# Altium schematic sheet slave_interface.SchDoc
size A4; SheetNumber: 5; SheetTotal: 5
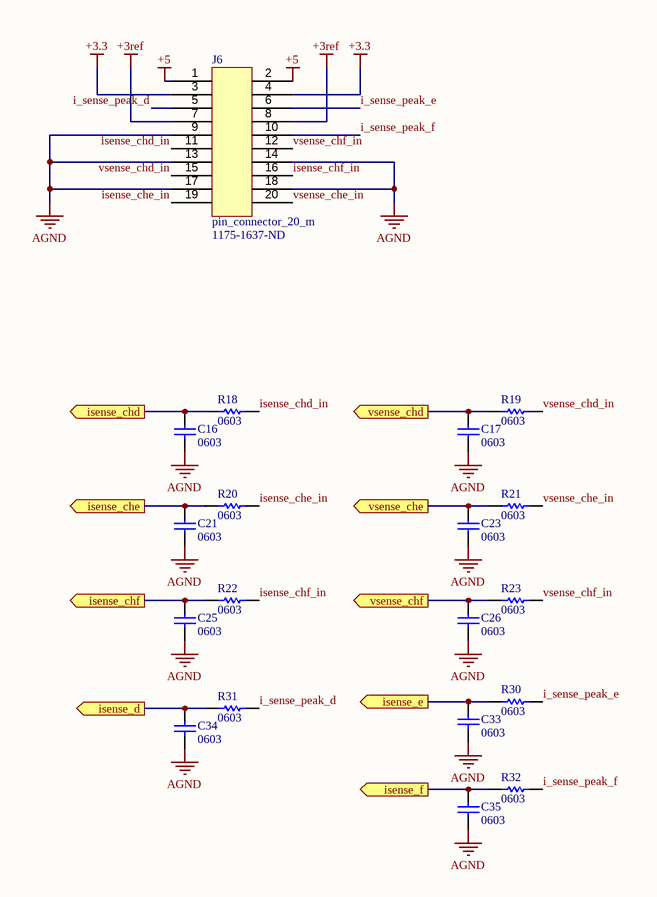
[diagram p0: slave_interface.SchDoc]

## Parts
C16  0603  [CAP 0603_1608]
C17  0603  [CAP 0603_1608]
C21  0603  [CAP 0603_1608]
C23  0603  [CAP 0603_1608]
C25  0603  [CAP 0603_1608]
C26  0603  [CAP 0603_1608]
C33  0603  [CAP 0603_1608]
C34  0603  [CAP 0603_1608]
C35  0603  [CAP 0603_1608]
J6  pin_connector_20_m  Supplier Part Number 1: 1175-1637-ND  [PIN_20_MALE_3220-20-0300-00]
R18  0603  [RES 0603_1608]
R19  0603  [RES 0603_1608]
R20  0603  [RES 0603_1608]
R21  0603  [RES 0603_1608]
R22  0603  [RES 0603_1608]
R23  0603  [RES 0603_1608]
R30  0603  [RES 0603_1608]
R31  0603  [RES 0603_1608]
R32  0603  [RES 0603_1608]

## Ports
isense_chd (out), isense_che (out), isense_chf (out), isense_d (out), isense_e (out), isense_f (out), vsense_chd (out), vsense_che (out), vsense_chf (out)

## Nets
+3.3: J6.3 J6.4
+3ref: J6.7 J6.8
+5: J6.1 J6.2
AGND: C16.1 C17.1 C21.1 C23.1 C25.1 C26.1 C33.1 C34.1 C35.1 J6.9 J6.13 J6.14 J6.17 J6.18
i_sense_peak_d: J6.5 R31.2
i_sense_peak_e: J6.6 R30.2
i_sense_peak_f: J6.10 R32.2
isense_chd: C16.2 R18.1 ; port isense_chd
isense_chd_in: J6.11 R18.2
isense_che: C21.2 R20.1 ; port isense_che
isense_che_in: J6.19 R20.2
isense_chf: C25.2 R22.1 ; port isense_chf
isense_chf_in: J6.16 R22.2
isense_d: C34.2 R31.1 ; port isense_d
isense_e: C33.2 R30.1 ; port isense_e
isense_f: C35.2 R32.1 ; port isense_f
vsense_chd: C17.2 R19.1 ; port vsense_chd
vsense_chd_in: J6.15 R19.2
vsense_che: C23.2 R21.1 ; port vsense_che
vsense_che_in: J6.20 R21.2
vsense_chf: C26.2 R23.1 ; port vsense_chf
vsense_chf_in: J6.12 R23.2

## Notes on the sheet
- 1
- 2
- 3
- 4
- A
- B
- C
- Project:
- D
- Date:
- Drawing number:
- Rev:
- Format:
- A4 Q
- Drawn by:
- Laboratory:
- Page
- Sheet:
- of
- File:

## Library data of the parts
C16 C17 C21 C23 C25 C26 C33-C35 = Cap: Capacitor; Published: 8-Jun-2000; LatestRevisionDate: 17-Jul-2002; LatestRevisionNote: Re-released for DXP Platform.; PackageReference: RAD-0.3; Publisher: Altium Limited; PackageDescription: Radial Cap, Thru-Hole; 2 Leads; 0.3 in Pin Spacing
R18-R23 R30-R32 = Res1: Resistor; Published: 8-Jun-2000; LatestRevisionDate: 17-Jul-2002; LatestRevisionNote: Re-released for DXP Platform.; PackageReference: AXIAL-0.3; Publisher: Altium Limited; PackageDescription: Axial Device, Thru-Hole; 2 Leads; 0.3 in Pin Spacing
J6 = pin_connector_20_m: Supplier 1: Digi-Key